# EAGLE design Fritzen_UM_r01_DRC_ok (EAGLE 7.5.0)
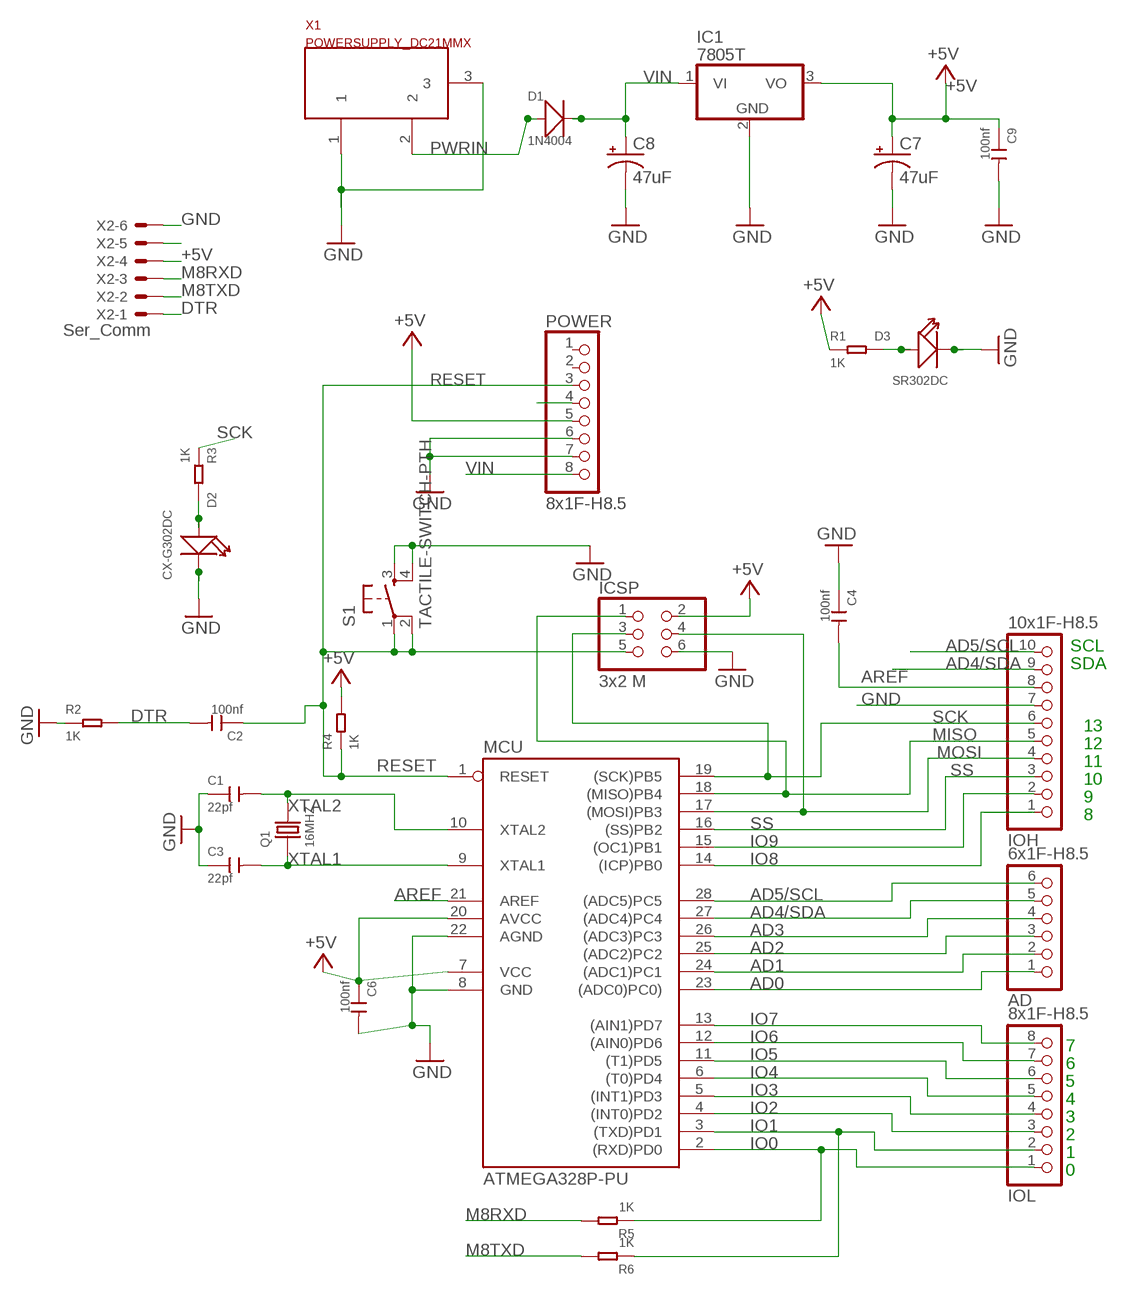
[diagram p0: schematic, sheet 1]

## Parts
AD  6x1F-H8.5  PINHD-1X6  [1X06]
C1  22pf  DIP-CERAMIC-DISC-22PF-50V-10%-NPO(D4.0MM)  [CERAMIC-2.54]
C2  100nf  DIP-CERAMIC-DISC-100NF-50V-Y5V(D5.0MM)  [CERAMIC-2.54]
C3  22pf  DIP-CERAMIC-DISC-22PF-50V-10%-NPO(D4.0MM)  [CERAMIC-2.54]
C4  100nf  DIP-CERAMIC-DISC-100NF-50V-Y5V(D5.0MM)  [CERAMIC-2.54]
C6  100nf  DIP-CERAMIC-DISC-100NF-50V-Y5V(D5.0MM)  [CERAMIC-2.54]
C7  47uF  CPOL-USE3.5-8  [E3,5-8]
C8  47uF  CPOL-USE3.5-8  [E3,5-8]
C9  100nf  DIP-CERAMIC-DISC-100NF-50V-Y5V(D5.0MM)  [CERAMIC-2.54]
D1  1N4004  DIP-DIODE-400V-1A(DO-41)  [DO-41]
D2  CX-G302DC  DIP-LED-GREEN-GREEN(2P-D3MM)  [LED2-2.54-D3.0MM]
D3  SR302DC  DIP-LED-RED-RED(2P-D3MM)  [LED2-2.54-D3.0MM]
IC1  7805T  [TO220H]
ICSP  3x2 M  PINHD-2X3  [2X03]
IOH  10x1F-H8.5  PINHD-1X10_ARD  [1X10]
IOL  8x1F-H8.5  PINHD-1X8  [1X08]
MCU  ATMEGA328P-PU  [DIL28-3]
POWER  8x1F-H8.5  PINHD-1X8  [1X08]
Q1  16MHZ  DIP-CRYSTAL-16MHZ-18PF-30PPM-50R(HC49US)  [HC49US]
R1  1K  DIP-RES-1K-5%-1/4W(PR-D2.3XL6.5MM)  [PR-D2.3XL6.5MM]
R2  1K  DIP-RES-1K-5%-1/4W(PR-D2.3XL6.5MM)  [PR-D2.3XL6.5MM]
R3  1K  DIP-RES-1K-5%-1/4W(PR-D2.3XL6.5MM)  [PR-D2.3XL6.5MM]
R4  1K  DIP-RES-1K-5%-1/4W(PR-D2.3XL6.5MM)  [PR-D2.3XL6.5MM]
R5  1K  DIP-RES-1K-5%-1/4W(PR-D2.3XL6.5MM)  [PR-D2.3XL6.5MM]
R6  1K  DIP-RES-1K-5%-1/4W(PR-D2.3XL6.5MM)  [PR-D2.3XL6.5MM]
S1  TACTILE-SWITCH-PTH  [TAC-SWITCH-PTH]
X1  POWERSUPPLY_DC21MMX  [POWERSUPPLY_DC-21MM]
X2  Ser_Comm  22-23-2061  [22-23-2061]

## Nets
+5V [usbvcc]: C6.1 C7.+ C9.1 IC1.3(VO) ICSP.2 MCU.7(VCC) MCU.20(AVCC) POWER.5 R1.1 R4.2 X2.4
AD0: AD.1 MCU.23((ADC0)PC0))
AD1: AD.2 MCU.24((ADC1)PC1)
AD2: AD.3 MCU.25((ADC2)PC2)
AD3: AD.4 MCU.26((ADC3)PC3)
AD4/SDA: AD.5 IOH.9 MCU.27((ADC4)PC4)
AD5/SCL: AD.6 IOH.10 MCU.28((ADC5)PC5)
AREF [aref]: C4.2 IOH.8 MCU.21(AREF)
DTR: C2.2 R2.2 X2.1
GND [gnd]: C1.1 C3.1 C4.1 C6.2 C7.- C8.- C9.2 D2.K(-) D3.K(-) IC1.2(GND) ICSP.6 IOH.7 MCU.8(GND) MCU.22(AGND) POWER.6 POWER.7 R2.1 S1.3 S1.4 X1.1 X1.3 X2.6
IO0: IOL.1 MCU.2((RXD)PD0) R5.1
IO1: IOL.2 MCU.3((TXD)PD1) R6.1
IO2: IOL.3 MCU.4((INT0)PD2)
IO3: IOL.4 MCU.5((INT1)PD3)
IO4: IOL.5 MCU.6((T0)PD4)
IO5: IOL.6 MCU.11((T1)PD5)
IO6: IOL.7 MCU.12((AIN0)PD6)
IO7: IOL.8 MCU.13((AIN1)PD7)
IO8: IOH.1 MCU.14((ICP)PB0)
IO9: IOH.2 MCU.15((OC1)PB1)
M8RXD: R5.2 X2.3
M8TXD: R6.2 X2.2
MISO: ICSP.1 IOH.5 MCU.18((MISO)PB4)
MOSI: ICSP.4 IOH.4 MCU.17((MOSI)PB3)
N$1: POWER.4
N$2: D2.A(+) R3.2
N$3: D3.A(+) R1.2
N$8: X2.5
PWRIN [power]: D1.1(+) X1.2
RESET: C2.1 ICSP.5 MCU.1(RESET) POWER.3 R4.1 S1.1 S1.2
SCK: ICSP.3 IOH.6 MCU.19((SCK)PB5) R3.1
SS: IOH.3 MCU.16((SS)PB2)
VIN [power]: C8.+ D1.2(-) IC1.1(VI) POWER.8
XTAL1: C3.2 MCU.9(XTAL1) Q1.1
XTAL2: C1.2 MCU.10(XTAL2) Q1.2
Unconnected: POWER.1 POWER.2

## Notes on the sheet
- SCL
- SDA
- 13
- 12
- 11
- 10
- 9
- 8
- 7
- 6
- 5
- 4
- 3
- 2
- 1
- 0

## Library data of the parts
AD = SmartPrj:PINHD-1X6: PIN HEADER
C1 C3 = Seeed-OPL-Capacitor:DIP-CERAMIC-DISC-22PF-50V-10%-NPO(D4.0MM): 302010200; MPN: CS1-D5Y5V2A104ZSP
C2 C4 C6 C9 = Seeed-OPL-Capacitor:DIP-CERAMIC-DISC-100NF-50V-Y5V(D5.0MM): 302010208; MPN: CC1-F5SL2A101KSPW
C7 C8 = rcl:CPOL-US: POLARIZED CAPACITOR, American symbol
D1 = Seeed-OPL-Diode:DIP-DIODE-400V-1A(DO-41): 304010008; MPN: 1N4004
D2 = Seeed-OPL-Diode:DIP-LED-GREEN-GREEN(2P-D3MM): 304090040; MPN: CX-G302DC
D3 = Seeed-OPL-Diode:DIP-LED-RED-RED(2P-D3MM): 304090041; MPN: SR302DC
IC1 = linear:78*: Positive VOLTAGE REGULATOR Source: http://cache.national.com/ds/LM/LM78L05.pdf http://www.fairchildsemi.com/ds/LM/LM7805.pdf
ICSP = SmartPrj:PINHD-2X3: PIN HEADER
IOH = SmartPrj:PINHD-1X10_ARD: PIN HEADER
IOL POWER = SmartPrj:PINHD-1X8: PIN HEADER
MCU = SmartPrj:ATMEGA328P-: MICROCONTROLLER 4 Kbytes FLASH 128 bytes SRAM 256 bytes EEPROM UART 6-channel 10 bit ADC
Q1 = Seeed-OPL-Crystal-Oscillator:DIP-CRYSTAL-16MHZ-18PF-30PPM-50R(HC49US): 306010037; MPN: 49S/18PF
R1-R6 = Seeed-OPL-Resistor:DIP-RES-1K-5%-1/4W(PR-D2.3XL6.5MM): 301020000; MPN: FHCFR-1/4W-102J
S1 = GeekAmmo:TACTILE-SWITCH: Tactile Switch 4 Pins, SPST NO
X1 = SmartPrj:POWERSUPPLY_DC21MM
X2 = con-molex:22-23-2061: .100" (2.54mm) Center Header - 6 Pin; MF: MOLEX; MPN: 22-23-2061; OC_FARNELL: 1462922; OC_NEWARK: 27C1933

## Net classes
0 default: width 0.254 mm, clearance 0.254 mm
1 power: width 0.61 mm, drill 0.61 mm, clearance 0.254 mm
2 gnd: width 0.305 mm, drill 0.559 mm, clearance 0.254 mm
3 usbvcc: width 0.508 mm, drill 0.61 mm, clearance 0.254 mm
4 aref: width 0.406 mm, drill 0.61 mm, clearance 0.254 mm

## Board
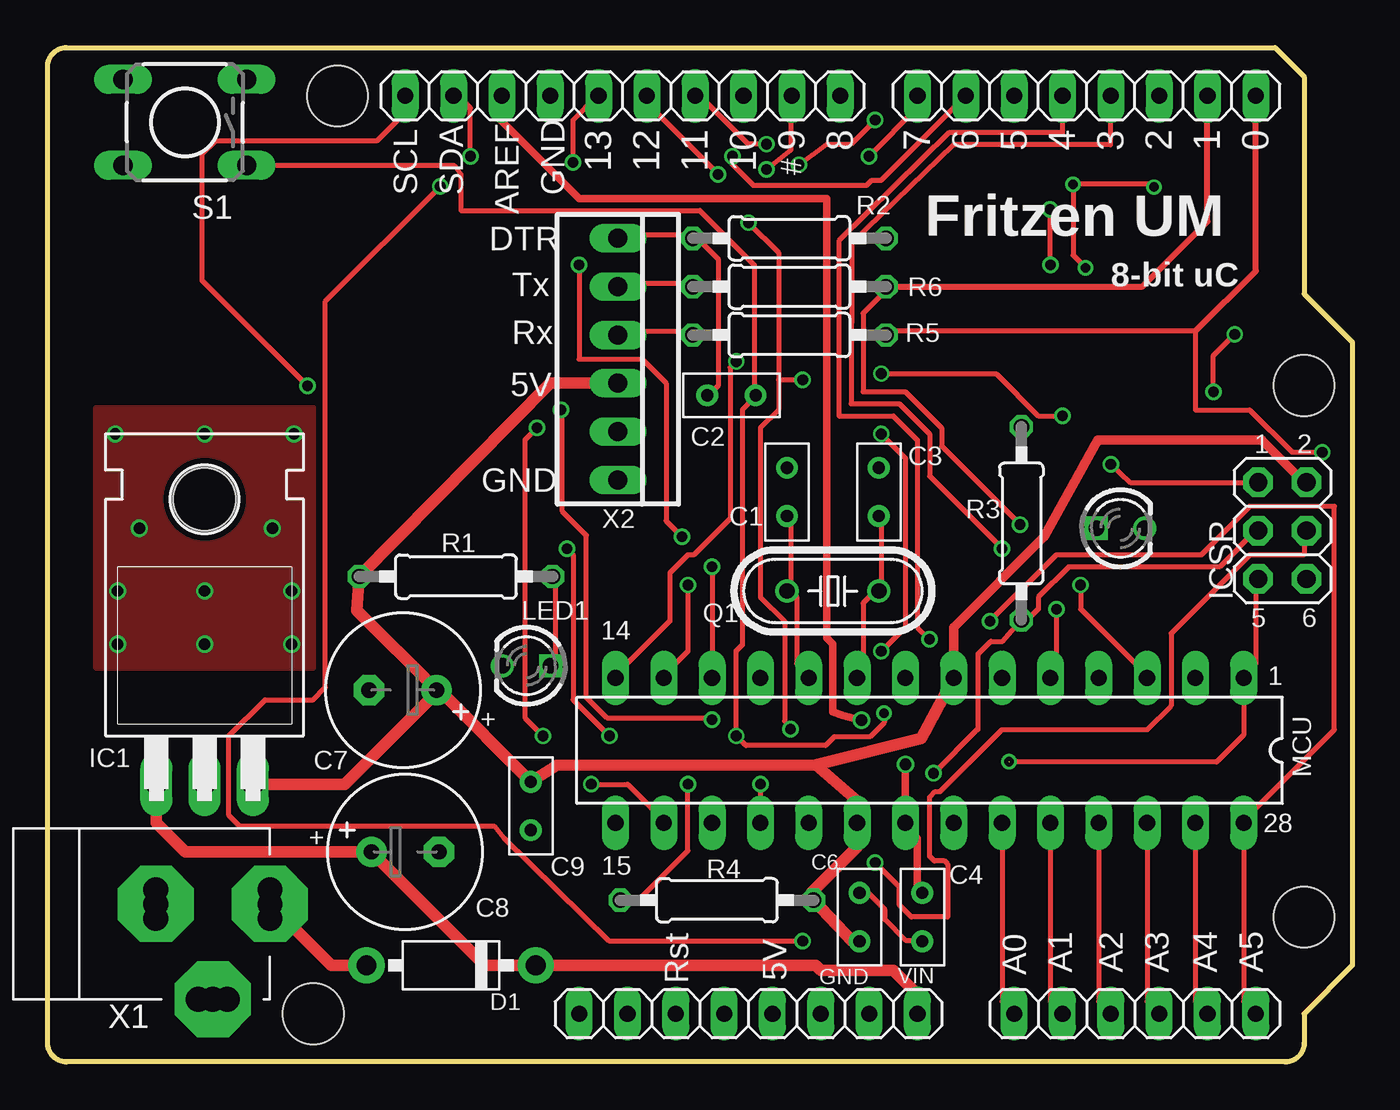
[diagram p1: board, top side]
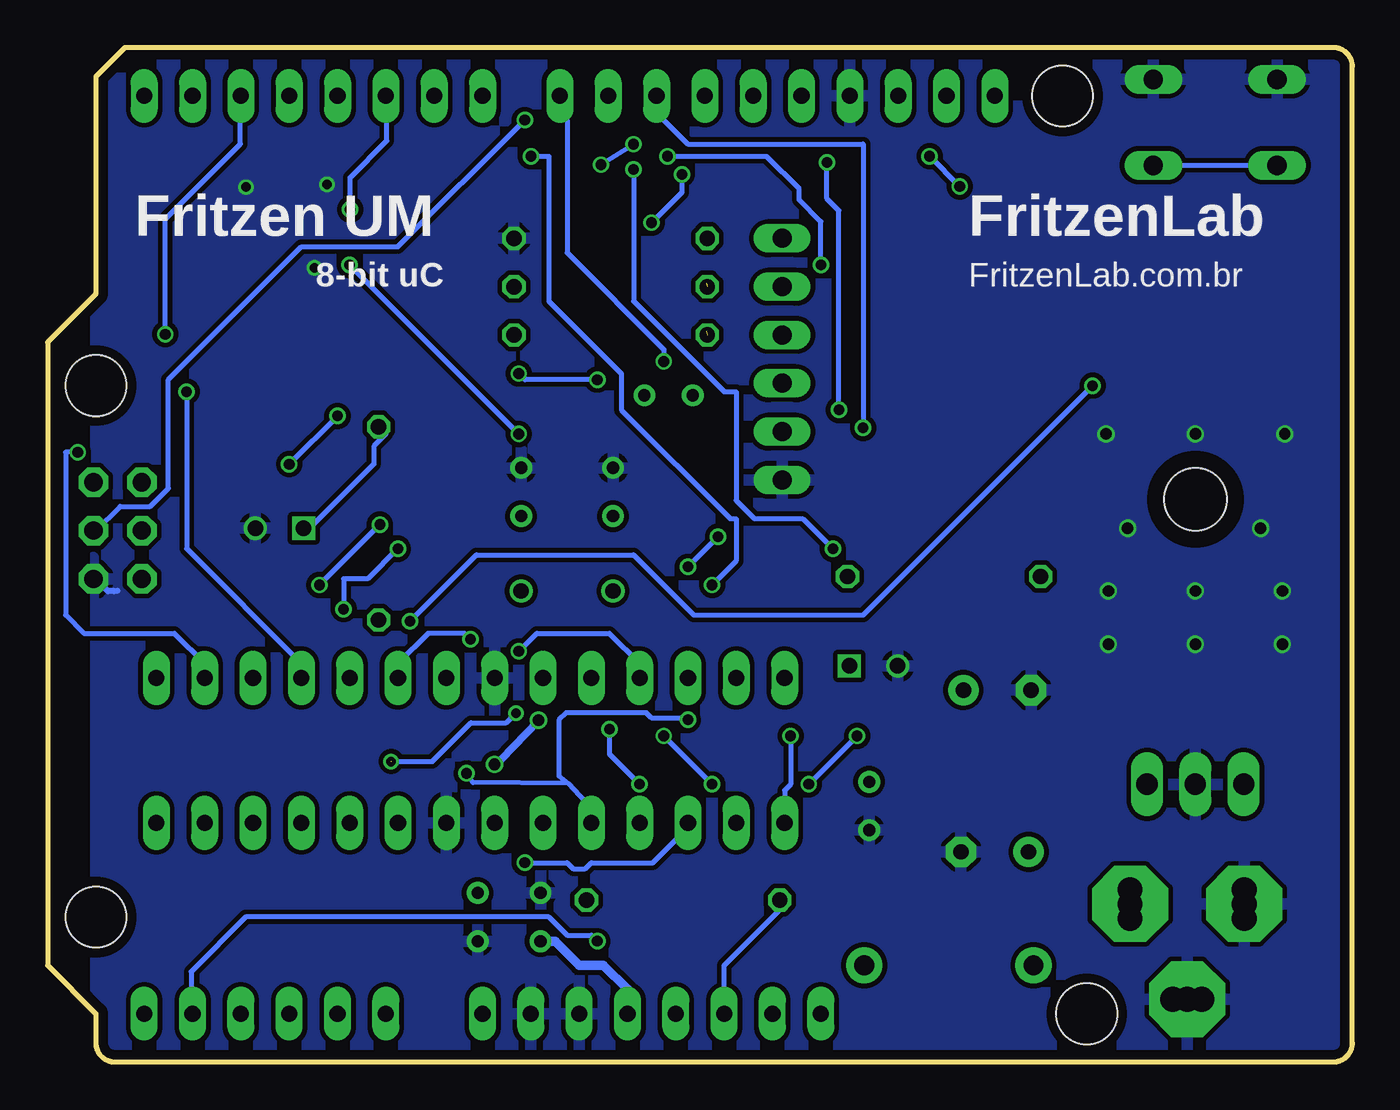
[diagram p2: board, bottom side, seen from below]

Size 68.58 x 53.34 mm. Coordinates in mm from the lower left corner, seen from the top.
Outline: 64.52,53.34 66.04,51.82 66.04,40.39 68.58,37.85 68.58,5.08 66.04,2.54 66.04,1 arc-90 65.04,0 1,0 arc-90 0,1 0,52.34 arc-90 1,53.34 64.52,53.34
Copper layers (1*16): Top 0.035mm / dielectric 1.6mm / Bottom 0.035mm
Design rules "Elecrow_2-layer_PCB_eagle_rule": minimum track width 6mil, minimum drill 12mil, track to track 6mil, track to pad 6mil, pad to pad 6mil, via to via 8mil, smd to smd 0mil, copper to edge 20mil, drill to drill 10mil, minimum pad ring 6mil, minimum via ring 6mil, stop-mask expansion 0mil, vias tented up to drill 100mil, thermal gap 10mil
Holes 3.2 mm at 66.04,35.56 66.04,7.62 15.24,50.8 13.97,2.54

### Footprints (pad centres in the part's own frame; a part is rotated, then mirrored left to right if it is on the bottom)
1X06 = drill 0.85 pad 1.422 long: 1 -6.35,0; 2 -3.81,0; 3 -1.27,0; 4 1.27,0; 5 3.81,0; 6 6.35,0
CERAMIC-2.54 = drill 0.635 pad 1.143: 1 -1.27,0; 2 1.27,0
E3,5-8 = drill 0.813 pad 1.6: + -1.778,0 | drill 0.813 pad 1.6 octagon: - 1.778,0
DO-41 = drill 1.041 pad 1.905: 1 -4.445,0; 2 4.445,0
LED2-2.54-D3.0MM = drill 0.813 square: A -1.27,0 | drill 0.813: K 1.27,0
TO220H = drill 1.118 long: 1 -2.54,-10.16; 2 0,-10.16; 3 2.54,-10.16 | hole 3.302: 0,4.826
2X03 = drill 0.95 pad 1.55 octagon: 1 -2.54,-1.27; 2 -2.54,1.27; 3 0,-1.27; 4 0,1.27; 5 2.54,-1.27; 6 2.54,1.27
1X10 = drill 0.85 pad 1.422 long: 1 -11.43,0; 2 -8.89,0; 3 -6.35,0; 4 -3.81,0; 5 -1.27,0; 6 1.27,0; 7 3.81,0; 8 6.35,0; 9 8.89,0; 10 11.43,0
1X08 = drill 0.85 pad 1.422 long: 1 -8.89,0; 2 -6.35,0; 3 -3.81,0; 4 -1.27,0; 5 1.27,0; 6 3.81,0; 7 6.35,0; 8 8.89,0
DIL28-3 = drill 0.85 pad 1.422 long: 1 -16.51,-3.81; 2 -13.97,-3.81; 3 -11.43,-3.81; 4 -8.89,-3.81; 5 -6.35,-3.81; 6 -3.81,-3.81; 7 -1.27,-3.81; 8 1.27,-3.81; 9 3.81,-3.81; 10 6.35,-3.81; 11 8.89,-3.81; 12 11.43,-3.81; 13 13.97,-3.81; 14 16.51,-3.81; 15 16.51,3.81; 16 13.97,3.81; 17 11.43,3.81; 18 8.89,3.81; 19 6.35,3.81; 20 3.81,3.81; 21 1.27,3.81; 22 -1.27,3.81; 23 -3.81,3.81; 24 -6.35,3.81; 25 -8.89,3.81; 26 -11.43,3.81; 27 -13.97,3.81; 28 -16.51,3.81
HC49US = drill 0.813: 1 -2.413,0; 2 2.413,0
PR-D2.3XL6.5MM = drill 0.813 octagon: 1 -4.953,0; 2 5.207,0
TAC-SWITCH-PTH = drill 1.016 pad 1.524 long: 1 -3.251,2.261; 2 3.251,2.261; 3 -3.251,-2.261; 4 3.251,-2.261
POWERSUPPLY_DC-21MM = drill 1.3 pad 4 octagon: 1 -5.08,-3.353; 2 -0.076,-6.35; 3 -0.076,-0.356 | drill 1.3: 4 -5.08,-4.115; 5 -5.08,-2.591; 6 -0.838,-0.356; 7 0.686,-0.356; 8 -0.838,-6.35; 9 0.686,-6.35
22-23-2061 = drill 1 long: 1 -6.35,0; 2 -3.81,0; 3 -1.27,0; 4 1.27,0; 5 3.81,0; 6 6.35,0

### Placement (x,y rotation side)
AD  57.15,2.54 0 top
C1  38.86,29.97 270 top
C2  35.94,35.05 180 top
C3  43.69,29.97 270 top
C4  45.97,7.62 90 top
C6  42.67,7.62 90 top
C7  18.67,19.56 180 top
C8  18.8,11.05 0 top
C9  25.4,13.46 270 top
D1  21.21,5.08 0 top
D2  56.39,28.07 0 top
D3  25.17,20.83 180 top
IC1  8.26,24.77 0 top
ICSP  64.9,27.94 270 top
IOH  30.23,50.8 180 top
IOL  54.61,50.8 180 top
MCU  46.35,16.38 180 top
POWER  36.83,2.54 0 top
Q1  41.27,24.77 180 top
R1  21.34,25.53 0 top
R2  39.12,43.31 180 top
R3  51.18,28.19 90 top
R4  35.05,8.51 0 top
R5  39.12,38.23 180 top
R6  39.12,40.77 180 top
S1  7.21,49.4 180 top
X1  5.33,8.38 90 top
X2  29.97,36.96 270 top

### Tracks (layer width: path | path; a pad name or v marks a point on that pad's centre or on a via)
+5V
  Top 0.508: MCU.7 47.62,22.86 52.39,27.62 55.18,32.7 63.82,32.7 66.04,30.48 ICSP.2
  Top 0.61: IC1.3 15.62,14.61 20.45,19.43 C7.+ | C7.+ 16.26,23.75 R1.1 26.42,35.69 X2.4 | C7.+ 20.57,19.56 C9.1 26.77,15.6 40.39,15.62 | 40.39,15.62 42.55,13.72 MCU.20 42.55,11.3 40.13,8.89 R4.2 42.29,6.35 C6.1 | MCU.7 45.92,17.02 40.39,15.62
  Bottom 0.508: POWER.5 38.1,3.81 39.37,5.08 40.64,5.08 41.91,6.35 C6.1
AD0
  Top 0.254: AD.1 50.16,3.17 MCU.23
AD1
  Top 0.254: AD.2 52.7,3.17 MCU.24
AD2
  Top 0.254: AD.3 55.24,3.17 MCU.25
AD3
  Top 0.254: AD.4 57.78,3.17 MCU.26
AD4/SDA  (via drill 0.56)
  Top 0.254: MCU.27 60.33,3.17 AD.5 | v22.23,47.62 22.23,50.16 21.59,50.8 IOH.9 | v20.64,46.04 14.61,40.01 14.61,19.68 13.97,19.05 11.43,19.05 9.53,17.14 9.53,12.95 10.1,12.38 23.5,12.38 24,11.75 29.53,6.35 v39.69,6.35
  Bottom 0.254: v20.64,46.04 v22.23,47.62 | v39.69,6.35 40.01,6.67 41.27,6.67 42.23,7.62 58.17,7.62 61.04,4.75 61.04,2.62 AD.5
AD5/SCL  (via drill 0.56)
  Top 0.254: AD.6 62.87,3.17 MCU.28 62.87,12.7 67.63,17.46 67.63,29.21 63.18,29.21 60.64,26.67 53.02,26.67 v49.53,23.18 | v13.65,35.56 8.13,41.08 8.13,47.75 8.83,48.45 17.34,48.45 17.53,48.64 17.77,48.88 18.8,49.91 IOH.10 18.73,50.8
  Bottom 0.254: v13.65,35.56 25.72,23.5 34.61,23.5 37.78,26.67 46.04,26.67 v49.53,23.18
AREF  (via drill 0.61)
  Top 0.406: C4.2 45.72,8.89 45.72,11.75 45.09,12.38 MCU.21 v45.09,15.65 | 24.13,50.8 IOH.8 23.88,49.47 27.94,45.4 40.96,45.4 40.96,22.29 41.27,21.97 41.27,18.41 41.8,18.22 v42.77,17.97
  Bottom 0.406: v42.77,17.97 44.77,15.88 v45.09,15.65
DTR
  Top 0.254: X2.1 30.16,43.5 33.97,43.5 R2.2 34.29,43.18 35.24,42.23 35.24,35.56 34.92,35.24 C2.2
GND  (via drill 0.5 pad 0.81, 0.6)
  Top 0.254: C6.2 43.13,8.89 43.99,8.03 43.99,7.49 45.09,6.4 45.92,6.4 C4.1 | v54.56,41.76 53.9,42.42 v53.9,46.15 53.9,46.18 57.99,46.18 58.17,46
  Bottom 0.305: ICSP.6 66.04,25.4 65.41,24.77 65.09,24.77 64.9,24.78
  other vias: 8.26,21.97 12.83,21.97 3.68,21.97 3.68,24.77 8.26,24.77 12.83,24.77 11.81,28.07 4.83,28.07 12.95,33.02 8.26,33.02 3.56,33.02 58.14,46
  pour Bottom: 0,53.34 66.04,53.34 66.04,39.24 66.04,22.23 66.04,4.95 66.04,0.13 55.63,0.13 42.55,0.13 31.11,0.13 19.18,0.13 9.78,0.13 0,0.13 0,0.89 0,12.06 0,21.84 0,30.99 0,38.35 0,47.12
  pour Top: 13.97,20.7 2.54,20.7 2.54,30.73 2.54,34.42 13.97,34.42 13.97,33.02 13.97,23.88
IO0  (via drill 0.56)
  Top 0.254: R5.1 44.45,38.42 60.33,38.42 60.33,34.29 63.18,34.29 65.41,32.07 v66.99,32.07
  Top 0.305: 60.33,38.42 63.5,41.59 IOL.1
  Bottom 0.254: MCU.2 60.33,20.95 61.91,22.54 66.67,22.54 67.63,23.5 67.63,32.07 v66.99,32.07
IO1  (via drill 0.56)
  Top 0.254: v54.29,25.08 54.29,23.81 57.78,20.32 MCU.3 | v51.12,28.26 46.99,32.38 46.99,33.34 45.09,35.24 42.86,35.24 42.86,39.37 44.13,40.64 R6.1
  Top 0.305: R6.1 57.53,40.77 60.96,44.2 IOL.2
  Bottom 0.254: v51.12,28.26 v54.29,25.08
IO2  (via drill 0.56)
  Top 0.254: v61.28,35.24 61.28,37.15 v62.4,38.27
  Bottom 0.254: MCU.4 55.24,20.95 61.28,26.99 v61.28,35.24 | v62.4,38.27 62.4,44.31 58.45,48.26 58.45,50.77 IOL.3
IO3  (via drill 0.56)
  Top 0.254: v53.02,23.81 53.02,20.64 52.7,20.32 MCU.5 | v50.16,26.99 46.35,30.8 46.35,33.02 44.77,34.61 42.23,34.61 42.25,43.07 47.64,48.22 55.85,48.22 IOL.4
  Bottom 0.254: v53.02,23.81 53.02,25.4 51.75,25.4 v50.16,26.99
IO4  (via drill 0.56)
  Top 0.254: v46.35,22.23 45.72,22.86 45.72,32.7 44.45,33.97 41.59,33.97 41.59,43.18 47.37,48.86 53.34,48.86 IOL.5
  Bottom 0.254: MCU.6 50.16,20.95 48.58,22.54 46.67,22.54 v46.35,22.23
IO5  (via drill 0.56)
  Top 0.254: v43.81,21.59 45.09,22.86 45.09,31.75 v43.81,33.02 | v52.7,41.91 52.7,44.81 v52.68,44.83
  Bottom 0.254: MCU.11 37.47,20.95 39.05,22.54 42.86,22.54 v43.81,21.59 | v52.7,41.91 v43.81,33.02 | v52.68,44.83 52.68,46.51 50.75,48.44 50.75,50.75 IOL.6
IO6  (via drill 0.56)
  Top 0.254: v34.92,26.04 MCU.12 | v27.94,41.91 27.94,36.96 31.24,36.96 32.51,35.69 32.51,28.45 v33.34,27.62 | v36.01,47.62 36.01,47.18 37.08,46.1 43.05,46.1 43.31,46.35 43.81,46.35 IOL.7
  Bottom 0.254: v33.34,27.62 v34.92,26.04 | v27.94,41.91 27.94,44.2 29.08,45.34 29.08,45.91 30.8,47.62 v36.01,47.62
IO7  (via drill 0.56)
  Top 0.254: v33.66,25.08 33.66,21.59 32.38,20.32 MCU.13 | v43.18,47.62 45.72,50.16 IOL.8
  Bottom 0.254: v33.66,25.08 32.38,26.35 32.38,28.57 32.7,28.57 38.42,34.29 38.42,36.2 42.23,40.01 42.23,47.62 v43.18,47.62
IO8  (via drill 0.56)
  Top 0.254: v36.2,36.83 35.88,36.51 35.88,28.57 33.97,26.67 33.66,26.67 32.7,25.72 32.7,23.18 29.84,20.32 MCU.14
  Bottom 0.254: v36.2,36.83 36.2,37.47 41.27,42.55 41.27,49.53 41.59,49.85 41.59,50.8 IOH.1
IO9  (via drill 0.56)
  Top 0.254: v29.53,17.14 27.62,19.05 27.62,26.67 v27.3,26.99 | v37.78,46.93 39.05,47.94 39.05,50.8 IOH.2
  Bottom 0.254: MCU.15 29.84,14.29 29.53,14.61 v29.53,17.14 | v27.3,26.99 28.89,28.57 31.43,28.57 32.38,29.53 32.38,35.24 33.02,35.24 37.78,40.01 v37.78,46.93
M8RXD  (1 unrouted)
  Top 0.254: 33.97,38.42 30.16,38.42 X2.3
M8TXD  (1 unrouted)
  Top 0.254: 33.97,40.96 30.16,40.96 X2.2
MISO  (via drill 0.56)
  Top 0.254: v37.47,14.61 MCU.18 | v39.05,17.5 38.73,17.92 38.73,23.18 37.47,24.45 37.47,33.34 38.42,34.29 38.42,35.88 | 38.42,35.88 38.42,42.55 v36.83,44.13 | v35.24,46.67 31.75,50.16 31.75,50.8 IOH.5 | ICSP.1 56.9,30.48 v55.88,31.43 | v53.34,33.97 52.07,33.97 49.85,36.2 v43.81,36.2 | 38.42,35.88 v39.69,35.88
  Bottom 0.254: v37.47,14.61 39.05,16.19 v39.05,17.5 | v36.83,44.13 35.24,45.72 v35.24,46.67 | v53.34,33.97 v55.88,31.43 | v43.81,36.2 43.5,35.88 v39.69,35.88
MOSI  (via drill 0.56)
  Top 0.254: v43.5,10.48 44.77,9.21 44.77,8.26 45.4,7.62 47.31,7.62 47.31,10.41 47.16,10.57 46.61,10.57 46.35,10.82 46.35,13.92 46.66,14.22 46.91,14.22 50.16,17.48 57.8,17.48 59.05,18.73 59.05,22.54 63.18,26.67 66.04,26.67 66.04,27.94 ICSP.4 | v37.78,48.26 36.83,48.26 34.29,50.8 IOH.4 | v43.5,49.53 42.23,48.26 40.96,48.26 v39.5,47.18
  Bottom 0.254: v43.5,10.48 41.27,10.48 40.96,10.16 40.32,10.16 40.01,10.48 39.99,10.46 36.78,10.46 34.92,12.32 MCU.17 | v39.5,47.18 v37.78,48.26 | v43.5,49.53 50.16,42.86 55.24,42.86 62.23,35.88 62.23,30.16 63.18,29.21 64.77,29.21 66.04,27.94 ICSP.4
N$2
  Bottom 0.254: 54.93,27.94 51.44,31.43 51.44,32.38 50.8,33.02 50.8,33.34 51.12,33.34 R3.2
  Bottom 0.61: 54.93,27.94 55.12,27.94 D2.A
N$3
  Top 0.254: 26.67,20.95 26.67,25.4 R1.2
  Top 0.61: D3.A 26.67,20.83 26.67,20.95
PWRIN
  Top 0.61: X1.2 14.91,5.08 D1.1
RESET  (via drill 0.5 pad 0.81, 0.56)  (1 unrouted)
  Top 0.254: MCU.1 62.87,20.32 63.5,20.95 63.5,25.4 ICSP.5 | 62.87,20 MCU.1 | v33.66,14.61 33.66,11.11 31.05,8.51 R4.1 | MCU.1 62.87,17.2 61.44,15.77 50.55,15.77 | v43.97,18.34 43.97,17.83 43.23,17.09 41.35,17.09 40.89,16.64 36.7,16.64 v36.2,17.14 36.2,21.61 36.49,21.91 36.51,21.91 36.51,34.29 37.15,34.92 C2.1 37.15,35.24 37.15,41.91 34.29,44.77 21.72,44.77 21.72,46.67 21.4,47.12 10.46,47.12 S1.1
  Bottom 0.254: POWER.3 33.02,5.08 29.97,8.13 R4.1 | v33.66,14.61 v36.2,17.14 | v50.52,15.8 48.36,15.8 46.33,17.83 44.48,17.83 v43.97,18.34 | S1.1 S1.2
SCK  (via drill 0.56)
  Top 0.254: R3.1 51.44,23.18 52.07,23.81 52.07,24.45 53.66,26.04 61.59,26.04 63.5,27.94 ICSP.3 | 48.9,17.5 48.9,21.44 49.58,22.12 50.19,22.12 R3.1 | 48.9,17.5 48.9,17.46 | 51.12,23.18 R3.1 | v27.62,47.31 27.62,49.53 28.89,50.8 IOH.6 | v26.99,34.29 27.05,34.23 27.05,28.96 28.32,27.69 28.32,19.18 29.4,18.1 34.82,18.1 v34.92,18 | v46.56,15.18 v46.57,15.18 48.9,17.5
  Bottom 0.254: MCU.19 40.01,13.34 41.21,14.64 | v27.62,47.31 27.62,45.4 26.99,44.77 v26.99,34.29 | v34.92,18 35.03,18.1 36.84,18.1 37.11,18.36 41.33,18.36 41.71,17.98 41.71,15.04 41.21,14.64 | 41.21,14.64 46.23,14.69 v46.56,15.18
SS  (via drill 0.56)
  Top 0.254: v28.57,14.61 30.48,14.61 32.38,12.7 MCU.16 | v26.04,17.14 25.08,18.1 25.08,32.7 v25.72,33.34
  Bottom 0.254: v26.04,17.14 v28.57,14.61 | v25.72,33.34 25.72,48.26 34.92,48.26 36.51,49.85 36.51,50.8 IOH.3
VIN
  Top 0.61: POWER.8 45.72,3.56 44.45,4.83 40.64,4.83 40.39,5.08 D1.2 22.99,5.08 C8.+ 7.24,11.05 5.71,12.57 IC1.1
XTAL1
  Top 0.254: C3.2 43.81,28.57 43.81,24.77 Q1.1 43.5,24.77 42.86,24.13 42.86,20.64 42.55,20.32 MCU.9
XTAL2
  Top 0.254: 39.05,24.77 39.05,28.57 C1.2 | 39.05,24.77 39.37,24.45 39.37,20.95 40.01,20.32 MCU.10 | 39.05,24.77 Q1.2

### Text on the board
tPlace: 13 | 12 | 11 | 10 | 9 | 8 | 7 | 6 | 5 | 4 | 3 | 2 | 1 | 0 | SCL | SDA | GND | AREF | R2 | DTR | Fritzen UM | 8-bit uC | Tx | R6 | Rx | R5 | 5V | C2 | 1 | 2 | GND | C3 | R3 | C1 | R1 | LED1 | Q1 | 5 | 6 | 14 | 1 | + | IC1 | C7 | MCU | 28 | + | R4 | C9 | 15 | C6 | C4 | C8 | 5V | GND | A0 | A1 | A2 | A3 | A4 | A5 | Rst | X1
bPlace: FritzenLab | Fritzen UM | FritzenLab.com.br | 8-bit uC
tNames: # | VIN
214bmp: D:/SmartProjects/Snc/a4_bn_logo2.bmp